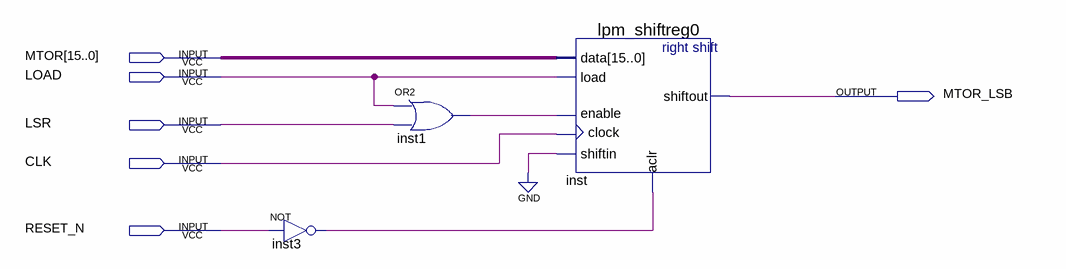
[diagram p0: schematic sheet]
// Quartus schematic wb_mul_shiftreg16right.bdf as structural Verilog: 3 symbols, 6 pins
module wb_mul_shiftreg16right (
  input  [15:0] MTOR,
  input  LOAD,
  input  LSR,
  input  CLK,
  input  RESET_N,
  output MTOR_LSB
);

  wire inst1_out, inst3_out;

  not inst3 (inst3_out, RESET_N);
  or inst1 (inst1_out, LOAD, LSR);
  lpm_shiftreg0 inst (
    .load(LOAD), .data(MTOR), .clock(CLK), .enable(inst1_out), .shiftin(1'b0), .aclr(inst3_out),
    .shiftout(MTOR_LSB));
endmodule
